# EAGLE design Prog-THT (EAGLE 9.6.2)
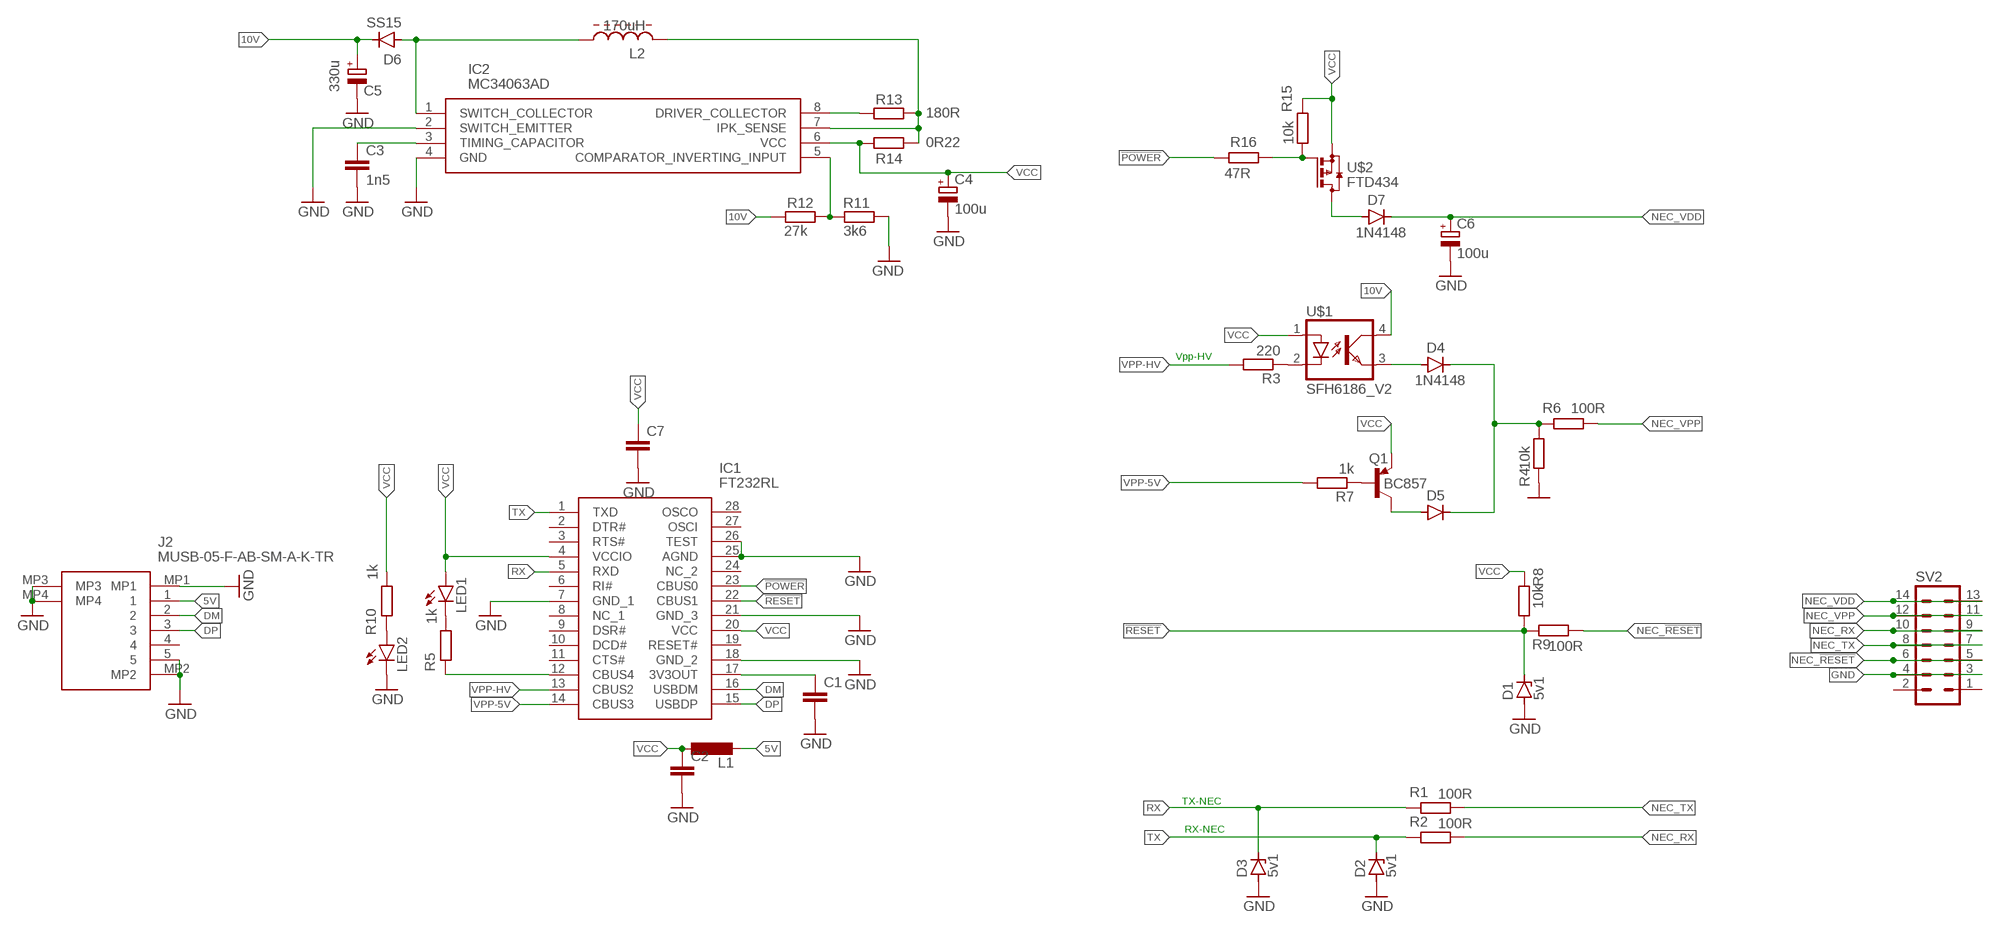
[diagram p0: schematic, sheet 1]

## Parts
C1  C-EUC0805  [C0805]
C2  C-EUC0805  [C0805]
C3  1n5  C-EUC0805  [C0805]
C4  100u  CPOL-EUSMCC  [SMC_C]
C5  330u  CPOL-EUSMCC  [SMC_C]
C6  100u  CPOL-EUSMCC  [SMC_C]
C7  C-EUC0805  [C0805]
D1  5v1  BZX90  [DO34Z7]
D2  5v1  BZX90  [DO34Z7]
D3  5v1  BZX90  [DO34Z7]
D4  1N4148  1N4148DO35-7  [DO35-7]
D5  1N4148  1N4148DO35-7  [DO35-7]
D6  SS15  GF1  [SMA-DO214AC]
D7  1N4148  1N4148DO35-7  [DO35-7]
IC1  FT232RL  [SOP65P778X200-28N]
IC2  MC34063AD  [SOIC127P600X175-8N]
J2  MUSB-05-F-AB-SM-A-K-TR  [MUSB05FABSMAKTR]
L1  L-EUL3216C  [L3216C]
L2  170uH  COIL  [NN]
LED1  LED3MM  [LED3MM]
LED2  LED3MM  [LED3MM]
Q1  BC857  BC857CSMD  [SOT23-BEC]
R1  100R  R-EU_0207/10  [0207/10]
R2  100R  R-EU_0207/10  [0207/10]
R3  220  R-EU_0207/10  [0207/10]
R4  10k  R-EU_0207/10  [0207/10]
R5  1k  R-EU_0207/10  [0207/10]
R6  100R  R-EU_0207/10  [0207/10]
R7  1k  R-EU_0207/10  [0207/10]
R8  10k  R-EU_0207/10  [0207/10]
R9  100R  R-EU_0207/10  [0207/10]
R10  1k  R-EU_0207/10  [0207/10]
R11  3k6  R-EU_0207/10  [0207/10]
R12  27k  R-EU_0207/10  [0207/10]
R13  180R  R-EU_0207/10  [0207/10]
R14  0R22  R-EU_0207/10  [0207/10]
R15  10k  R-EU_R0805  [R0805]
R16  47R  R-EU_0207/10  [0207/10]
SV2  MA07-2  [MA07-2]
U$1  SFH6186_V2  [SOP254P978X406-4N]
U$2  FTD434  [SOT230P700X180-4N]

## Nets
5V: J2.1 L1.2
10V: C5.+ D6.K(C) R12.2 U$1.4(COL)
!POWER: IC1.23(CBUS0) R16.2
!RESET: D1.C IC1.22(CBUS1) R8.1 R9.2
DM: IC1.16(USBDM) J2.2
DP: IC1.15(USBDP) J2.3
GND: C1.2 C2.2 C3.2 C4.- C5.- C6.- C7.2 D1.A D2.A D3.A IC1.7(GND_1) IC1.18(GND_2) IC1.21(GND_3) IC1.25(AGND) IC1.26(TEST) IC2.2(SWITCH_EMITTER) IC2.4(GND) J2.5 J2.MP1 J2.MP2 J2.MP3 J2.MP4 LED2.K(C) R4.2 R11.1 SV2.3 SV2.4
N$1: D4.C D5.C R4.1 R6.2
N$2: R3.1 U$1.2(C)
N$3: D4.A U$1.3(EMIT)
N$4: D5.A Q1.C
N$5: Q1.B R7.1
N$6: LED1.K(C) R5.1
N$7: IC1.12(CBUS4) R5.2
N$8: C1.1 IC1.17(3V3OUT)
N$9: IC2.5(COMPARATOR_INVERTING_INPUT) R11.2 R12.1
N$10: IC2.8(DRIVER_COLLECTOR) R13.1
N$11: C3.1 IC2.3(TIMING_CAPACITOR)
N$12: R15.2 R16.1 U$2.1(G)
N$13: IC2.7(IPK_SENSE) L2.P$2 R13.2 R14.2
N$14: D7.A U$2.2(D) U$2.4(D)
N$15: D6.A IC2.1(SWITCH_COLLECTOR) L2.P$1
N$17: LED2.A R10.2
NEC_!RESET: R9.1 SV2.5 SV2.6
NEC_RX: R2.1 SV2.9 SV2.10
NEC_TX: R1.1 SV2.7 SV2.8
NEC_VDD: C6.+ D7.C SV2.13 SV2.14
NEC_VPP: R6.1 SV2.11 SV2.12
RX: D3.C IC1.5(RXD) R1.2
TX: D2.C IC1.1(TXD) R2.2
VCC: C2.1 C4.+ C7.1 IC1.4(VCCIO) IC1.20(VCC) IC2.6(VCC) L1.1 LED1.A Q1.E R8.2 R10.1 R14.1 R15.1 U$1.1(A) U$2.3(S)
VPP-5V: IC1.14(CBUS3) R7.2
VPP-HV: IC1.13(CBUS2) R3.2
Unconnected: IC1.2(DTR#) IC1.3(RTS#) IC1.6(RI#) IC1.8(NC_1) IC1.9(DSR#) IC1.10(DCD#) IC1.11(CTS#) IC1.19(RESET#) IC1.24(NC_2) IC1.27(OSCI) IC1.28(OSCO) J2.4 SV2.1 SV2.2

## Notes on the sheet
- Vpp-HV
- TX-NEC
- RX-NEC

## Library data of the parts
C1-C3 C7 = rcl:C-EU: CAPACITOR, European symbol; SPICEPREFIX: C
C4-C6 = rcl:CPOL-EU: POLARIZED CAPACITOR, European symbol; SPICEPREFIX: C
D1-D3 = diode:BZX90: Z DIODE
D4 D5 D7 = diode:1N4148: DIODE high speed (Philips)
D6 = diode2:GF1: DIODE
IC1 = FT232RL:FT232RL: USB to serial TTL level UART FT232RL FT232RL, Universal Asynchronous Receiver & Transmitter 3MBd, 28-Pin, SSOP Source: Datasheet <http://www.ftdichip.com/Support/Documents/DataSheets/ICs/DS_FT232R.pdf>; ARROW_PART_NUMBER: FT232RL; ARROW_PRICE-STOCK: https://www.arrow.com/en/products/ft232rl/ftdi-chip?region=nac; DESCRIPTION: USB to serial TTL level UART FT232RL FT232RL, Universal Asynchronous Receiver & Transmitter 3MBd, 28-Pin, SSOP; HEIGHT: 2mm; MANUFACTURER_NAME: FTDI Chip; MANUFACTURER_PART_NUMBER: FT232RL
IC2 = MC34063AD:MC34063AD: Step up/down converter,MC34063AD 98pcs Source: Datasheet <http://www.onsemi.com/pub/Collateral/MC34063A-D.PDF>; ARROW_PART_NUMBER: MC34063AD; ARROW_PRICE-STOCK: https://www.arrow.com/en/products/mc34063ad/on-semiconductor; DESCRIPTION: Step up/down converter,MC34063AD 98pcs; HEIGHT: 1.75mm; MANUFACTURER_NAME: onsemi; MANUFACTURER_PART_NUMBER: MC34063AD; MOUSER_PART_NUMBER: 512-MC34063AD; MOUSER_PRICE-STOCK: http://www.mouser.com/Search/ProductDetail.aspx?qs=qJQOsIEC8WHIuBHtgH5ZSQ%3d%3d
J2 = MUSB-05-F-AB-SM-A-K-TR:MUSB-05-F-AB-SM-A-K-TR: USB Connectors Mini USB 2.0 Interface Source: Datasheet <http://suddendocs.samtec.com/prints/musb-05-x-ab-sm-a-xx-mkt.pdf>; ARROW_PART_NUMBER: MUSB-05-F-AB-SM-A-K-TR; ARROW_PRICE-STOCK: https://www.arrow.com/en/products/musb-05-f-ab-sm-a-k-tr/samtec?region=nac; DESCRIPTION: USB Connectors Mini USB 2.0 Interface; HEIGHT: 4.1mm; MANUFACTURER_NAME: SAMTEC; MANUFACTURER_PART_NUMBER: MUSB-05-F-AB-SM-A-K-TR; MOUSER_PART_NUMBER: 200-MUSB05FABSMAKTR; MOUSER_PRICE-STOCK: https://www.mouser.co.uk/ProductDetail/Samtec/MUSB-05-F-AB-SM-A-K-TR?qs=FESYatJ8odIUaVE%2F1ECHaA%3D%3D
L1 = rcl:L-EU: INDUCTOR, European symbol; SPICEPREFIX: L
L2 = DławikProgramator:COIL
LED1 LED2 = led:LED: LED OSRAM: - CHIPLED LG R971, LG N971, LY N971, LG Q971, LY Q971, LO R971, LY R971 LH N974, LH R974 LS Q976, LO Q976, LY Q976 LO Q996 - Hyper CHIPLED LW Q18S LB Q993, LB Q99A, LB R99A - SideLED LS A670, LO A670, LY A670, LG A670, LP A670 LB A673, LV A673, LT A673, LW A673 LH A674 LY A675 LS A676, LA A676, LO A676, LY A676, LW A676 LS A679, LY A679, LG A679 - Hyper Micro SIDELED® LS Y876, LA Y876, LO Y876, LY Y876 LT Y87S - SmartLED LW L88C, LW L88S LB L89C, LB L89S, LG L890 LS L89K, LO L89K, LY L89K LS L896, LA L896, LO L896, LY L896 - TOPLED LS T670, LO T670, LY T670, LG T670, LP T670 LSG T670, LSP T670, LSY T670, LOP T670, LYG T670 LG T671, LOG T671, LSG T671 LB T673, LV T673, LT T673, LW T673 LH T674 LS T676, LA T676, LO T676, LY T676, LB T676, LH T676, LSB T676, LW T676 LB T67C, LV T67C, LT T67C, LS T67K, LO T67K, LY T67K, LW E67C LS E67B, LA E67B, LO E67B, LY E67B, LB E67C, LV E67C, LT E67C LW T67C LS T679, LY T679, LG T679 LS T770, LO T770, LY T770, LG T770, LP T770 LB T773, LV T773, LT T773, LW T773 LH T774 LS E675, LA E675, LY E675, LS T675 LS T776, LA T776, LO T776, LY T776, LB T776 LHGB T686 LT T68C, LB T68C - Hyper Mini TOPLED® LB M676 - Mini TOPLED Santana® LG M470 LS M47K, LO M47K, LY M47K Source: http://www.osram.convergy.de LUXEON: - LUMILED® LXK2-PW12-R00, LXK2-PW12-S00, LXK2-PW14-U00, LXK2-PW14-V00 LXK2-PM12-R00, LXK2-PM12-S00, LXK2-PM14-U00 LXK2-PE12-Q00, LXK2-PE12-R00, LXK2-PE12-S00, LXK2-PE14-T00, LXK2-PE14-U00 LXK2-PB12-K00, LXK2-PB12-L00, LXK2-PB12-M00, LXK2-PB14-N00, LXK2-PB14-P00, LXK2-PB14-Q00 LXK2-PR12-L00, LXK2-PR12-M00, LXK2-PR14-Q00, LXK2-PR14-R00 LXK2-PD12-Q00, LXK2-PD12-R00, LXK2-PD12-S00 LXK2-PH12-R00, LXK2-PH12-S00 LXK2-PL12-P00, LXK2-PL12-Q00, LXK2-PL12-R00 Source: www.luxeon.com KINGBRIGHT: KA-3528ASYC Source: www.kingbright.com
Q1 = transistor-pnp:BC857*: PNP Transistror
R1-R16 = rcl:R-EU_: RESISTOR, European symbol; SPICEPREFIX: R
SV2 = con-lstb:MA07-2: PIN HEADER; OC_FARNELL: unknown; OC_NEWARK: unknown
U$1 = SFH6186-3X001:SFH6186_V2
U$2 = FDT434P:FTD434

## Board
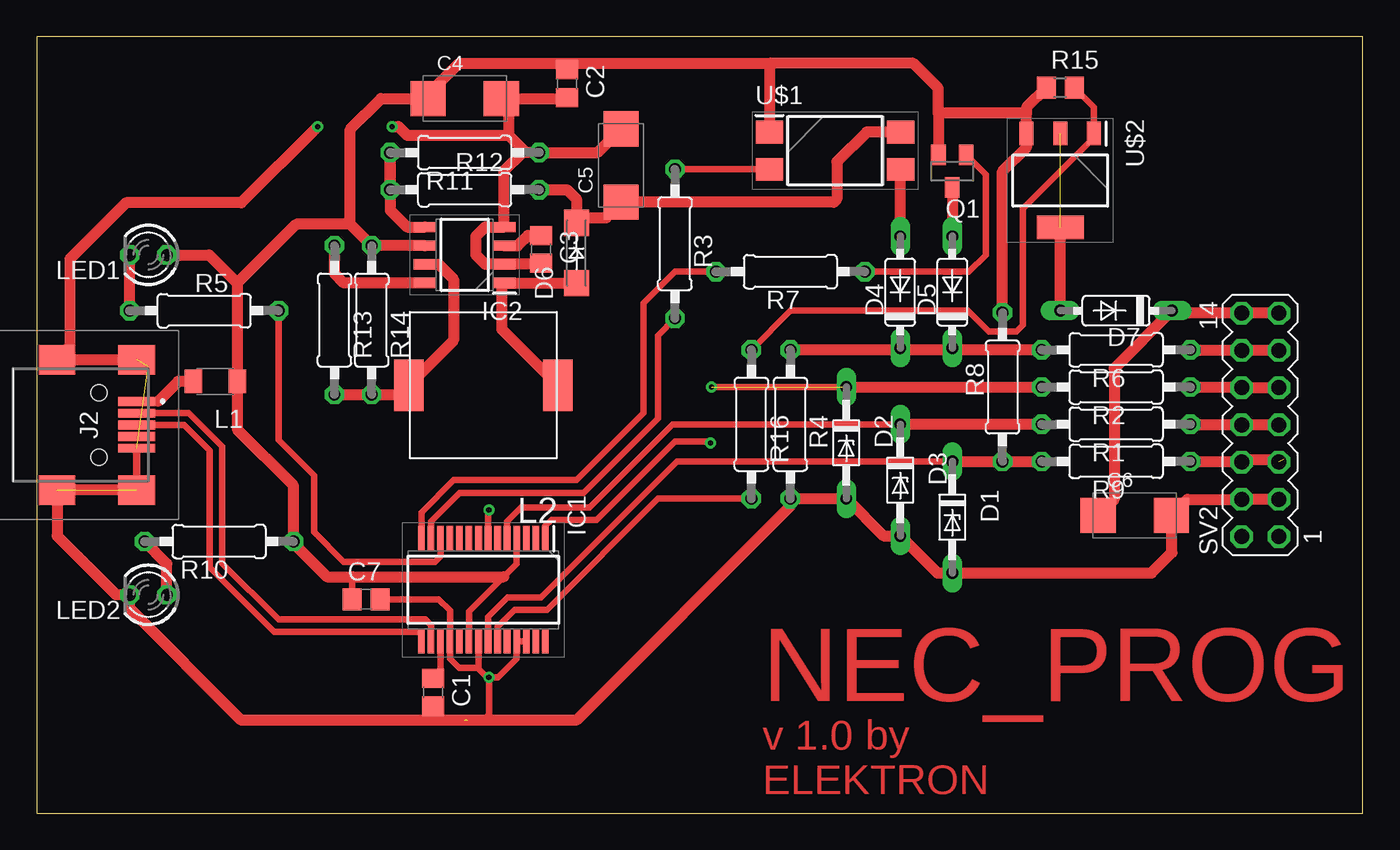
[diagram p1: board, top side]
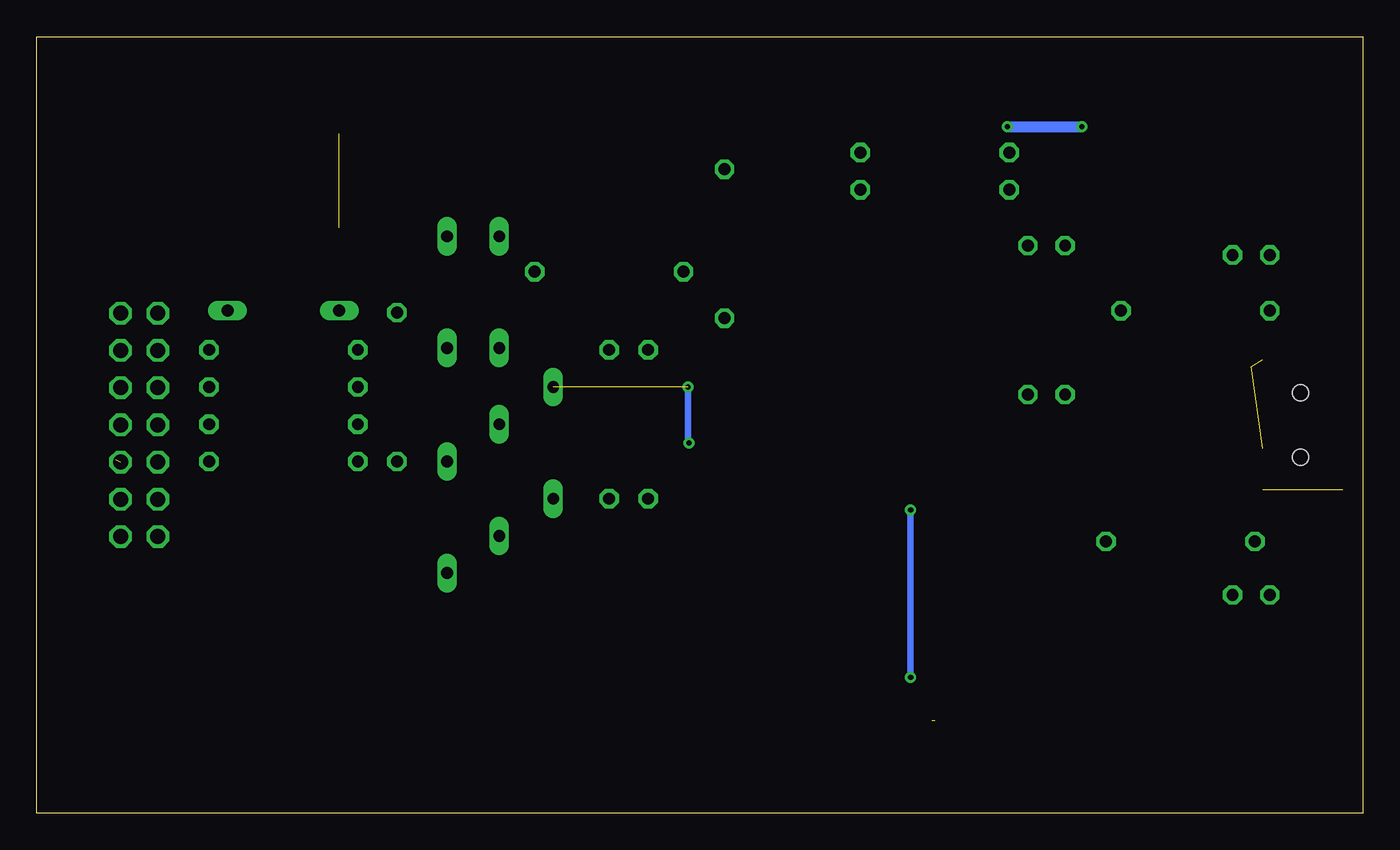
[diagram p2: board, bottom side, seen from below]

Size 90.5 x 53 mm. Coordinates in mm from the lower left corner, seen from the top.
Outline: 0,0 90.5,0 90.5,53 0,53 0,0
Copper layers (1*16): Top 0.035mm / dielectric 1.5mm / Bottom 0.035mm
Design rules "default": minimum track width 6mil, minimum drill 0.35mm, track to track 6mil, track to pad 6mil, pad to pad 6mil, via to via 6mil, smd to smd 6mil, copper to edge 40mil, drill to drill 6mil, minimum pad ring 10mil, minimum via ring 8mil, stop-mask expansion 4mil, vias tented up to drill 0mil, thermal gap 10mil

### Footprints (pad centres in the part's own frame; a part is rotated, then mirrored left to right if it is on the bottom)
C0805 = smd 1.3 x 1.5: 1 -0.95,0; 2 0.95,0
SMC_C = smd 2.4 x 2.4: + -2.5,0; - 2.5,0
DO34Z7 = drill 0.813 long: A 3.81,0; C -3.81,0
DO35-7 = drill 0.813 long: A 3.81,0; C -3.81,0
SMA-DO214AC = smd 1.8 x 1.7: A -2.05,0; K 2.05,0
SOP65P778X200-28N = smd 1.7 x 0.45: 1 -3.5,4.225; 2 -3.5,3.575; 3 -3.5,2.925; 4 -3.5,2.275; 5 -3.5,1.625; 6 -3.5,0.975; 7 -3.5,0.325; 8 -3.5,-0.325; 9 -3.5,-0.975; 10 -3.5,-1.625; 11 -3.5,-2.275; 12 -3.5,-2.925; 13 -3.5,-3.575; 14 -3.5,-4.225; 15 3.5,-4.225; 16 3.5,-3.575; 17 3.5,-2.925; 18 3.5,-2.275; 19 3.5,-1.625; 20 3.5,-0.975; 21 3.5,-0.325; 22 3.5,0.325; 23 3.5,0.975; 24 3.5,1.625; 25 3.5,2.275; 26 3.5,2.925; 27 3.5,3.575; 28 3.5,4.225
SOIC127P600X175-8N = smd 1.525 x 0.7: 1 -2.712,1.905; 2 -2.712,0.635; 3 -2.712,-0.635; 4 -2.712,-1.905; 5 2.712,-1.905; 6 2.712,-0.635; 7 2.712,0.635; 8 2.712,1.905
MUSB05FABSMAKTR = smd 0.6 x 2.5: 1 -1.6,3.83; 2 -0.8,3.83; 3 0,3.83; 4 0.8,3.83; 5 1.6,3.83 | smd 2 x 2.5: MP1 -4.45,3.83; MP2 4.45,3.83; MP3 -4.45,-1.62; MP4 4.45,-1.62 | hole 1.1: -2.2,1.25; 2.2,1.25
L3216C = smd 1.2 x 1.6: 1 -1.5,0; 2 1.5,0
NN = smd 2 x 3.5: P$1 -5.08,0; P$2 5.08,0
LED3MM = drill 0.813 octagon: A -1.27,0; K 1.27,0
SOT23-BEC = smd 1 x 1.4: B -0.95,-1.1; C 0,1.1; E 0.95,-1.1
0207/10 = drill 0.813 octagon: 1 -5.08,0; 2 5.08,0
R0805 = smd 1.3 x 1.5: 1 -0.95,0; 2 0.95,0
MA07-2 = drill 1.016 octagon: 1 -7.62,-1.27; 2 -7.62,1.27; 3 -5.08,-1.27; 4 -5.08,1.27; 5 -2.54,-1.27; 6 -2.54,1.27; 7 0,-1.27; 8 0,1.27; 9 2.54,-1.27; 10 2.54,1.27; 11 5.08,-1.27; 12 5.08,1.27; 13 7.62,-1.27; 14 7.62,1.27
SOP254P978X406-4N = smd 1.85 x 1.55: 1 -4.475,1.27; 2 -4.475,-1.27; 3 4.475,-1.27; 4 4.475,1.27
SOT230P700X180-4N = smd 1.6 x 0.95: 1 -3.2,2.3; 2 -3.2,0; 3 -3.2,-2.3 | smd 1.6 x 3.2: 4 3.2,0

### Placement (x,y rotation side)
C1  27.05,8.26 270 top
C2  36.2,49.78 270 top
C3  34.42,38.48 270 top
C4  29.21,48.77 0 top
C5  39.88,44.2 90 top
C6  74.93,20.32 0 top
C7  22.48,14.61 0 top
D1  62.48,20.19 270 top
D2  55.24,25.27 270 top
D3  58.93,22.73 270 top
D4  58.93,35.56 90 top
D5  62.48,35.56 90 top
D6  36.83,38.23 90 top
D7  73.66,34.29 180 top
IC1  30.48,15.24 270 top
IC2  29.21,38.1 180 top
J2  3,26.5 270 top
L1  12.19,29.46 180 top
L2  30.48,29.21 180 top
LED1  7.62,38.1 180 top
LED2  7.62,14.9 180 top
Q1  62.48,43.81 180 top
R1  73.66,26.54 180 top
R2  73.66,29.08 180 top
R3  43.56,38.86 270 top
R4  51.44,26.54 270 top
R5  11.43,34.29 0 top
R6  73.66,31.62 180 top
R7  51.44,36.96 180 top
R8  65.91,29.08 90 top
R9  73.66,24 180 top
R10  12.45,18.54 180 top
R11  29.21,45.09 180 top
R12  29.21,42.55 0 top
R13  20.32,33.66 270 top
R14  22.86,33.66 270 top
R15  69.85,49.53 0 top
R16  48.77,26.54 270 top
SV2  83.5,26.5 90 top
U$1  54.48,45.21 0 top
U$2  69.85,43.18 270 top

### Tracks (layer width: path | path; a pad name or v marks a point on that pad's centre or on a via)
5V
  Top 0.508: J2.1 8.29,28.1
  Top 0.762: L1.2 9.65,29.46 8.29,28.1
10V
  Top 0.762: R12.2 36.2,42.55 36.83,41.91 D6.K 37.19,40.64 38.86,40.64 38.86,40.68 C5.+ 54.4,41.7 54.61,41.91 54.61,44.45 56.64,46.48 U$1.4
!POWER
  Top 0.457: R16.2 42.42,21.46 34.81,13.86 32.61,13.86 31.45,12.7 IC1.23
!RESET
  Top 0.457: D1.C 43.69,24 34.42,14.73 32.13,14.73 30.8,13.41 IC1.22
  Top 0.762: D1.C R8.1 R9.2
DM
  Top 0.457: IC1.16 26.91,12.83 26.53,13.21 16.51,13.21 12.68,17.04 12.68,25.02 10.39,27.3 J2.2
DP
  Top 0.457: J2.3 10.08,26.5 11.81,24.77 11.81,16.76 16.2,12.38 26.13,12.38 26.25,12.25 IC1.15
GND  (via drill 0.35)  (4 unrouted)
  Top 0.457: IC1.26 IC1.25 32.76,10.53 31.5,9.27 v30.86,9.27 | IC1.7 30.8,20.64 v30.86,20.7 | v30.86,9.27 30.73,9.27 30.1,9.91 | 30.1,9.91 28.83,9.91 28.2,10.53 IC1.18 28.2,13.83 27.43,14.61 C7.2 | IC1.21 30.16,9.96 30.1,9.91 | 27.37,6.35 27.05,6.67 C1.2 | v30.86,9.27 30.86,6.73 30.48,6.35
  Top 0.508: J2.MP2 J2.5
  Top 0.762: SV2.3 SV2.4 78.53,21.42 C6.- 77.47,20.28 77.47,17.78 76.07,16.38 D1.A 61.47,16.38 D3.A 57.78,18.92 D2.A R4.2 51.44,20.95 36.83,6.35 30.48,6.35 29.4,6.35 | 7.62,30.48 7.15,30.95 J2.MP3 2.27,31.84 2.27,37.83 6.1,41.66 13.97,41.66 v19.18,46.86 | C3.2 34.35,37.47 IC2.2 30.61,37.47 29.97,38.1 29.97,39.37 30.61,40.01 IC2.4 31.88,40.05 31.88,43.81 33.15,45.09 | 33.15,45.09 R11.1 38.27,45.09 C5.- | 33.15,45.09 33.27,45.21 32.21,46.27 | J2.MP2 1.4,22.05 1.4,18.92 5.42,14.9 LED2.K 6.35,13.97 13.97,6.35 27.37,6.35 29.21,6.35 | C2.2 36.13,48.77 C4.- 32.22,48.26 32.22,46.28 32.21,46.27 | v24.26,46.86 24.7,46.86 25.29,46.27 32.21,46.27
  Bottom 0.457: v30.86,20.7 v30.86,9.27
  Bottom 0.762: v24.26,46.86 v19.18,46.86
N$1
  Top 0.762: R6.2 62.36,31.62 | 58.8,31.62 62.23,31.62 62.36,31.62 | 58.8,31.62 R4.1 | D4.C 58.8,31.62 | D5.C 62.36,31.62
N$2
  Top 0.457: U$1.2 R3.1
N$3
  Top 0.762: D4.A 58.93,43.91 U$1.3
N$4
  Top 0.762: Q1.C D5.A
N$5
  Top 0.457: Q1.B 64.77,43.58 64.77,38.1 63.63,36.96 R7.1
N$6
  Top 0.762: R5.1 LED1.K
N$7
  Top 0.457: IC1.12 27.55,17.52 27.18,17.14 20.95,17.14 18.92,19.18 18.92,23.05 16.51,25.46 R5.2
N$8
  Top 0.457: IC1.17 27.55,9.84 27.05,9.33 C1.1
N$9
  Top 0.762: R12.1 R11.2 24.13,41.15 25.27,40.01 IC2.5
N$10
  Top 0.762: IC2.8 20.95,36.2 20.32,36.83 R13.1
N$11
  Top 0.762: IC2.3 32.83,38.73 33.53,39.43 C3.1
N$12
  Top 0.457: R15.2 72.14,48.19 72.14,46.39 U$2.1 72.15,46.12 67.31,41.27 67.31,33.33 66.85,32.87 64.97,32.87 63.55,34.29 51.44,34.29 R16.1
N$13
  Top 0.762: R13.2 R14.2 24.77,28.57 L2.P$2 28.45,32.26 28.45,36.45 27.43,37.47 IC2.7
N$14  (1 unrouted)
  Top 0.762: D7.A U$2.4
N$15
  Top 0.762: L2.P$1 31.75,33.02 31.75,36.02 IC2.1 36.81,36.2 D6.A
N$17
  Top 0.762: LED2.A 8.89,17.02 R10.2
NEC_!RESET  (1 unrouted)
  Top 0.762: R9.1 82.19,24 SV2.6 82.4,24.13 85.09,24.13
NEC_RX
  Top 0.762: R2.1 82.19,29.08 SV2.10 SV2.9
NEC_TX
  Top 0.762: SV2.7 SV2.8 78.78,26.5 R1.1
NEC_VDD
  Top 0.762: SV2.13 SV2.14 77.64,34.12 D7.C 73.53,30.35 73.53,21.42 C6.+
NEC_VPP
  Top 0.762: SV2.11 SV2.12 78.78,31.58 R6.1
RX
  Top 0.457: IC1.5 32.1,19.91 33.07,20.88 37.72,20.88 43.38,26.54 D3.C
  Top 0.762: R1.2 D3.C
TX  (via drill 0.35)  (1 unrouted)
  Top 0.457: v45.97,25.27 45.89,25.35 43.56,25.35 38.22,20.02 35.13,20.02 34.7,19.59 IC1.1 | v46.05,29.08 D2.C
  Top 0.762: D2.C R2.2
  Bottom 0.457: v46.05,29.08 46.05,25.4 45.97,25.4 v45.97,25.27
VCC
  Top 0.457: IC1.20 29.5,13.76 31.88,16.13 32.76,17.01 IC1.4 | C7.1 21.53,16.07 21.59,16.13
  Top 0.762: 36.64,51.18 28.83,51.18 26.71,49.06 C4.+ 23.5,48.77 21.4,46.67 21.4,40.2 | 36.64,51.18 50.01,51.18 | 67.55,47.77 U$2.3 67.56,46.37 67.56,45.47 65.91,43.81 R8.2 | 50.01,51.18 U$1.1 | 61.53,47.77 61.53,49.46 59.82,51.18 50.04,51.18 50.01,51.18 | IC2.6 R14.1 21.4,40.2 | 13.69,36.17 L1.1 13.69,26.19 17.53,22.35 R10.1 17.53,18.41 19.81,16.13 21.59,16.13 31.88,16.13 | 13.69,36.17 17.72,40.2 21.4,40.2 | LED1.A 11.76,38.1 13.69,36.17 | 61.53,47.77 Q1.E | 67.55,47.77 61.53,47.77 | R15.1 67.55,48.18 67.55,47.77 | C2.1 36.64,51.18
VPP-5V
  Top 0.457: IC1.14 26.25,20.54 28.45,22.73 36.83,22.73 41.4,27.3 41.4,34.8 43.56,36.96 R7.2
VPP-HV
  Top 0.457: IC1.13 26.91,19.92 28.85,21.87 37.34,21.87 42.39,26.93 42.39,32.61 R3.2

### Text on the board
Top: NEC_PROG | v 1.0 by / ELEKTRON